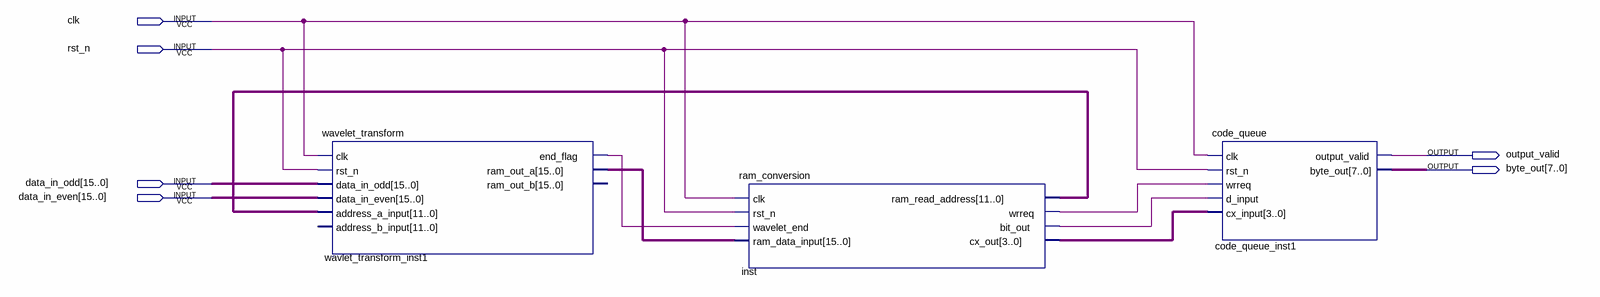
[diagram p0: schematic sheet]
// Quartus schematic img_coder.bdf as structural Verilog: 3 symbols, 6 pins
module img_coder (
  input  clk,
  input  rst_n,
  input  [15:0] data_in_odd,
  input  [15:0] data_in_even,
  output output_valid,
  output [7:0] byte_out
);

  wire inst_bit_out, inst_wrreq, wavlet_transform_inst1_end_flag;
  wire [3:0] inst_cx_out;
  wire [11:0] inst_ram_read_address;
  wire [15:0] wavlet_transform_inst1_ram_out_a;

  wavelet_transform wavlet_transform_inst1 (
    .clk(clk), .rst_n(rst_n), .data_in_odd(data_in_odd), .data_in_even(data_in_even),
    .address_a_input(inst_ram_read_address), .end_flag(wavlet_transform_inst1_end_flag),
    .ram_out_a(wavlet_transform_inst1_ram_out_a));  // open: address_b_input, ram_out_b
  ram_conversion inst (
    .clk(clk), .rst_n(rst_n), .wavelet_end(wavlet_transform_inst1_end_flag),
    .ram_data_input(wavlet_transform_inst1_ram_out_a), .ram_read_address(inst_ram_read_address),
    .wrreq(inst_wrreq), .bit_out(inst_bit_out), .cx_out(inst_cx_out));
  code_queue code_queue_inst1 (
    .clk(clk), .rst_n(rst_n), .wrreq(inst_wrreq), .d_input(inst_bit_out), .cx_input(inst_cx_out),
    .output_valid(output_valid), .byte_out(byte_out));
endmodule
